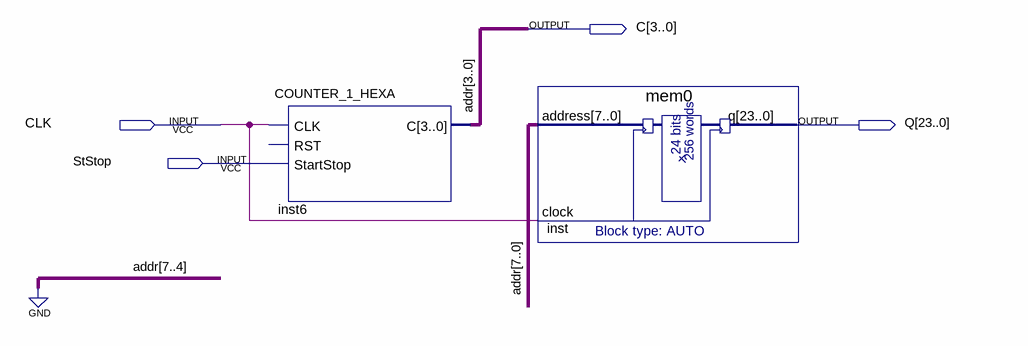
[diagram p0: schematic sheet]
// Quartus schematic tmp_2.bdf as structural Verilog: 2 symbols, 4 pins
module tmp_2 (
  input  CLK,
  input  StStop,
  output [3:0] C,
  output [23:0] Q
);

  COUNTER_1_HEXA inst6 (.CLK(CLK), .StartStop(StStop), .C(C));  // open: RST
  mem0 inst (.address({4'b0000, C}), .clock(CLK), .q(Q));

  // Other names for the same wires on the sheet: addr[3:0] = C
endmodule
